# EasyEDA schematic schematic.json
TITLE: Rez; REV: 1.0; Date: 2026-04-18; Sheet: 1/1; Drawn By: reztheperson; Company: Your Company
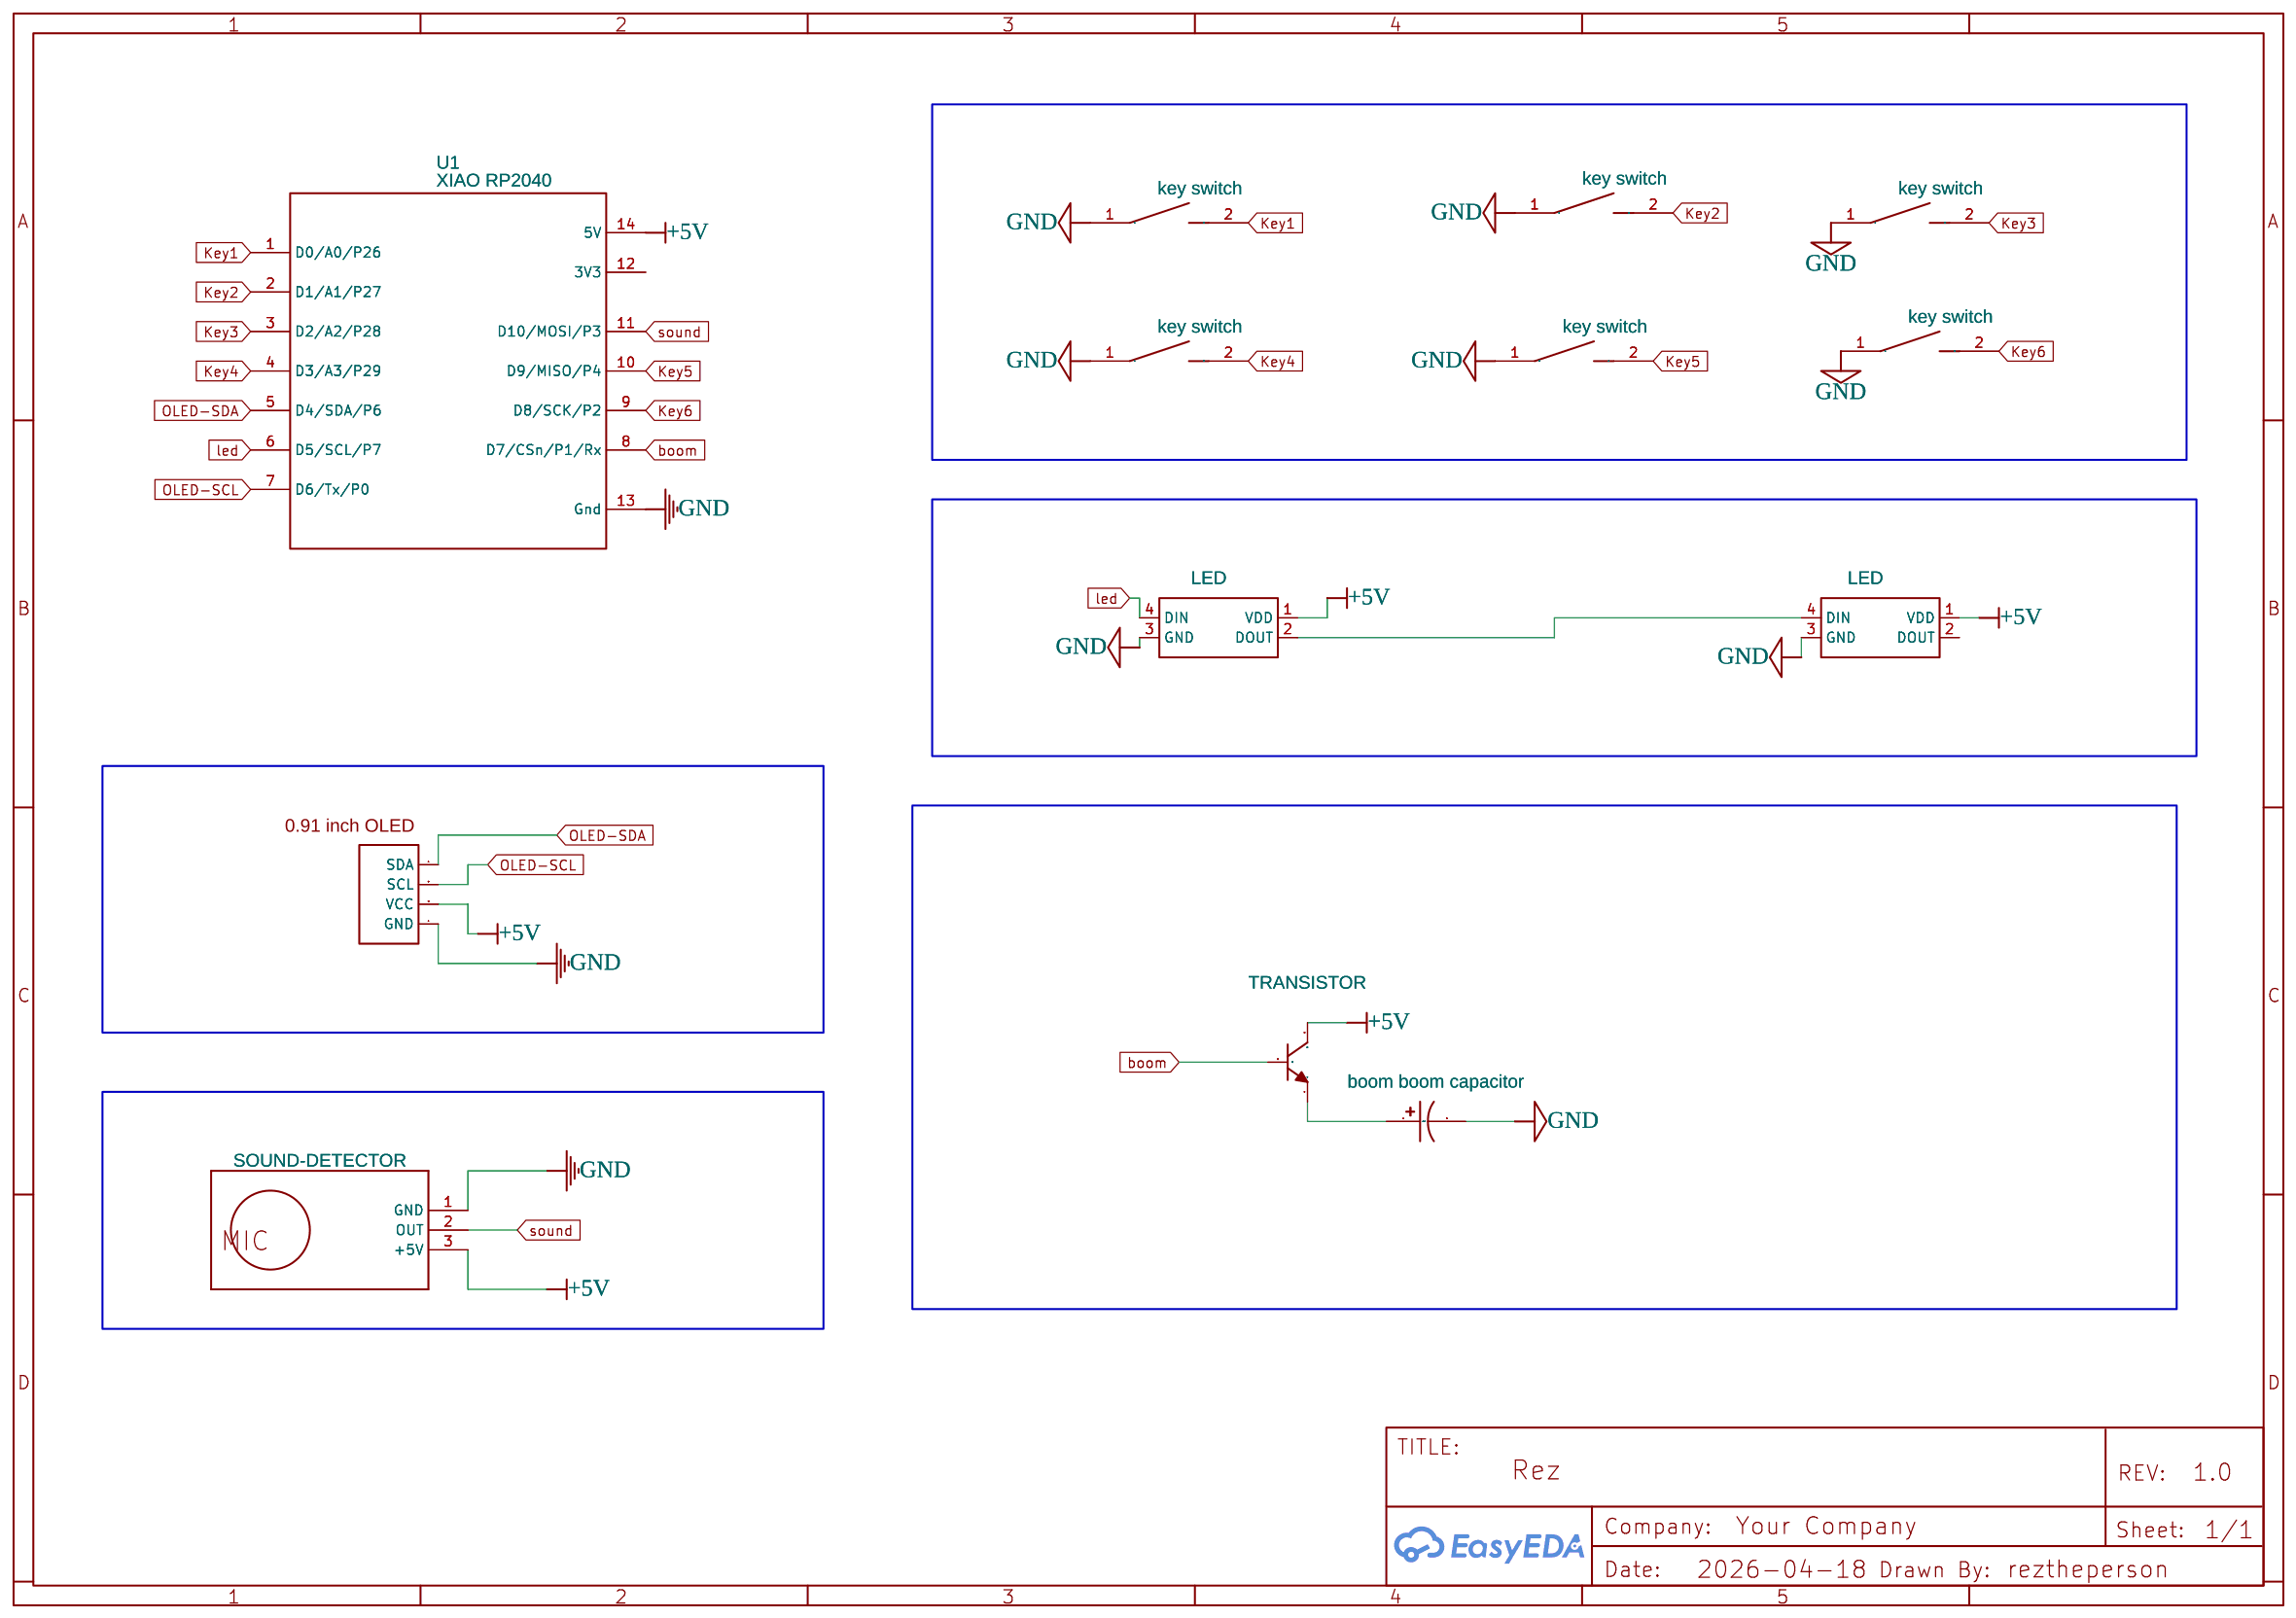
[diagram p0: schematic sheet]

## Parts
C1  boom boom capacitor  [CAP-TH_BD6.3-P2.50-D0.5-FD]
LED  SK6812MINI-EA  [LED-SMD_4P-L3.2-W2.8_SK6812MINI-EA]
LED#2  SK6812MINI-EA  [LED-SMD_4P-L3.2-W2.8_SK6812MINI-EA]
TRANSISTOR  2SC2411KT146R  [SOT-346_L2.9-W1.6-P1.90-LS2.8-TR-CW]
U1  XIAO RP2040  [XAIO RP2040]
U2  key switch  [CHERRY MX]
U3  key switch  [CHERRY MX]
U4  key switch  [CHERRY MX]
U5  key switch  [CHERRY MX]
U6  key switch  [CHERRY MX]
U7  key switch  [CHERRY MX]
U8  OLED_0.91 inch  [OLED_0.91 INCH]
U9  SOUND-DETECTOR  [SOUND-DETECTOR]

## Library data of the parts
C1 = 226BPS035M: Supplier: LCSC; Supplier Part: C7172434; Manufacturer: Illinois Capacitor; Contributor: lcsc; JLCPCB Part Class: Extended Part
LED LED#2 = SK6812MINI-EA: Supplier: LCSC; Supplier Part: C5378731; Manufacturer: 欧思科光电; JLCPCB Part Class: Extended Part; Contributor: lcsc
TRANSISTOR = 2SC2411KT146R: Contributor: LCSC; Supplier: LCSC; Supplier Part: C122622; Manufacturer: ROHM(罗姆); JLCPCB Part Class: Extended Part
U1 = XIAO RP2040: Manufacturer: Seeed Studio; Supplier: Seeed Studio; link: https://www.seeedstudio.com/Seeed-Studio-XIAO-RP2040-3PCS-p-5942.html; Contributor: osbojo
U2-U7 = CHERRY_MX: Manufacturer Part: CHERRY; Contributor: drummdan; Supplier: Reichelt
U8 = OLED_0.91 inch: Contributor: Maulik Shah
U9 = SOUND-DETECTOR: Sound Detection Module

## Nets
+5V: LED.1(VDD) LED#2.1(VDD) TRANSISTOR.3(C) U1.14(5V) U8.3(VCC) U9.3(+5V)
GND: C1.2 LED.3(GND) LED#2.3(GND) U1.13(Gnd) U2.1 U3.1 U4.1 U5.1 U6.1 U7.1 U8.4(GND) U9.1(GND)
boom: TRANSISTOR.2(B) U1.8(D7/CSn/P1/Rx)
Key1: U1.1(D0/A0/P26) U2.2
Key2: U1.2(D1/A1/P27) U3.2
Key3: U1.3(D2/A2/P28) U4.2
Key4: U1.4(D3/A3/P29) U5.2
Key5: U1.10(D9/MISO/P4) U6.2
Key6: U1.9(D8/SCK/P2) U7.2
led: LED.4(DIN) U1.6(D5/SCL/P7)
OLED-SCL: U1.7(D6/Tx/P0) U8.2(SCL)
OLED-SDA: U1.5(D4/SDA/P6) U8.1(SDA)
sound: U1.11(D10/MOSI/P3) U9.2(OUT)
Net-(C1-1): C1.1 TRANSISTOR.1(E)
Net-(LED-2): LED.2(DOUT) LED#2.4(DIN)

Not connected (* = marked no-connect by the designer): LED#2 2(DOUT); U1 12(3V3)
